# EAGLE design 4_digit_7seg_driver (EAGLE 7.3.0)
CNAME: Alta designs; CREVISION: v0.1; DESIGNER: Eduardo Medeiros
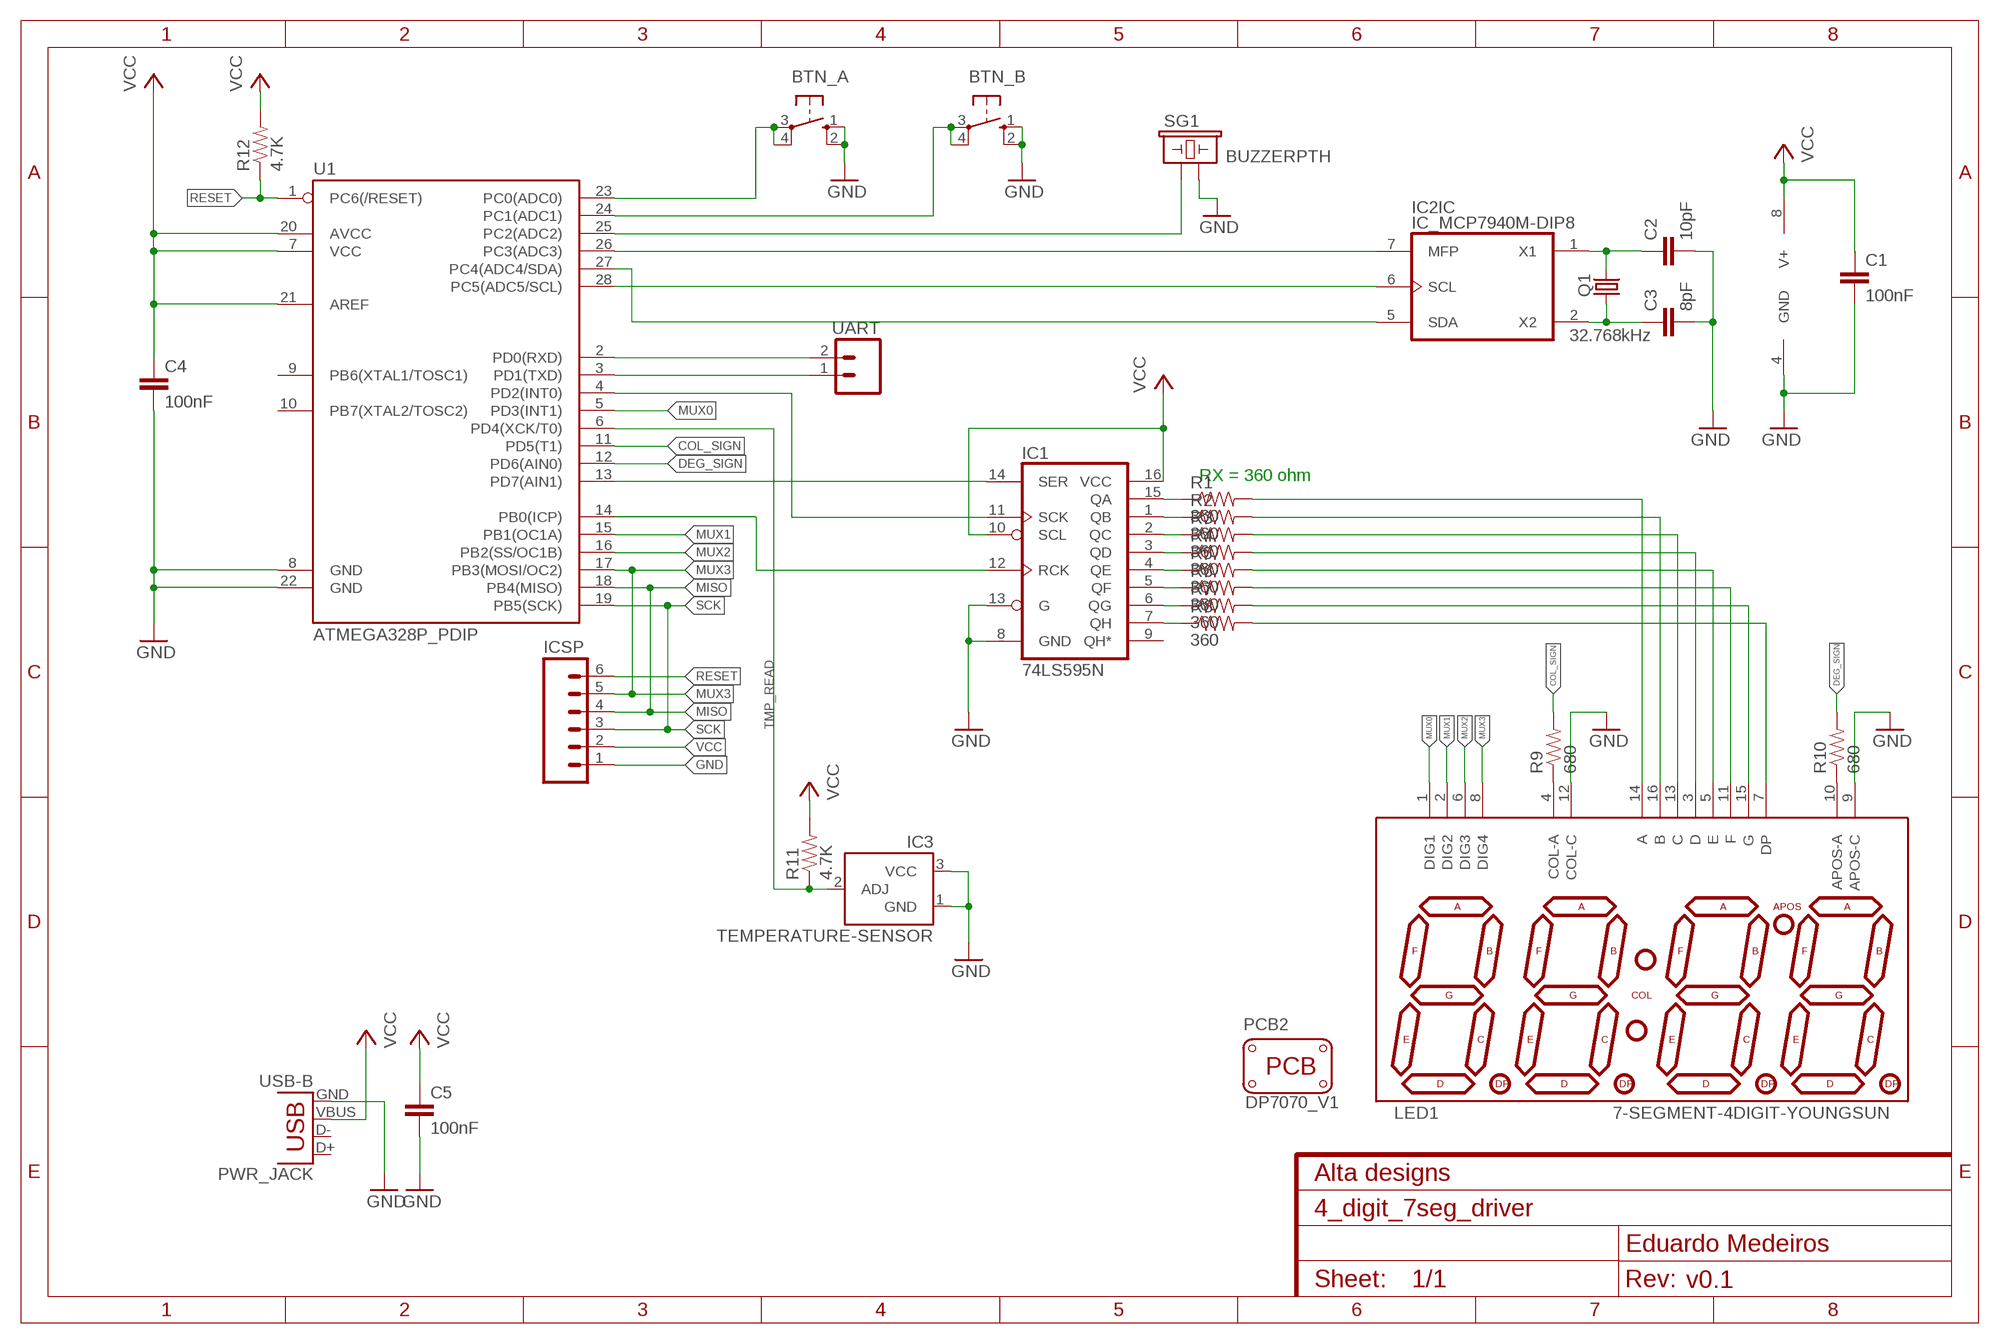
[diagram p0: schematic, sheet 1]

## Parts
BTN_A  40-XX  [B3F-40XX]
BTN_B  40-XX  [B3F-40XX]
C1  100nF  CAPPTH1  [CAP-PTH-5MM]
C2  10pF  CAPPTH  [CAP-PTH-SMALL]
C3  8pF  CAPPTH  [CAP-PTH-SMALL]
C4  100nF  CAPPTH1  [CAP-PTH-5MM]
C5  100nF  CAPPTH1  [CAP-PTH-5MM]
IC1  74LS595N  [DIL16]
IC2  IC_MCP7940M-DIP8  [DIP8]
IC3  TEMPERATURE-SENSOR  [TO-92]
ICSP  M06SILK_FEMALE_PTH  [1X06]
LED1  7-SEGMENT-4DIGIT-YOUNGSUN  [7-SEGMENT-4DIGIT-YOUNGSUN]
PCB2  PCB_DP_SQUARE-7X7  [DP7070_V1]
PWR_JACK  USB-B  USBPTH  [USB-B-PTH]
Q1  32.768kHz  CRYSTALTC26V  [TC26V]
R1  360  RESISTORPTH-1/4W-VERT  [AXIAL-0.1]
R2  360  RESISTORPTH-1/4W-VERT  [AXIAL-0.1]
R3  360  RESISTORPTH-1/4W-VERT  [AXIAL-0.1]
R4  360  RESISTORPTH-1/4W-VERT  [AXIAL-0.1]
R5  360  RESISTORPTH-1/4W-VERT  [AXIAL-0.1]
R6  360  RESISTORPTH-1/4W-VERT  [AXIAL-0.1]
R7  360  RESISTORPTH-1/4W-VERT  [AXIAL-0.1]
R8  360  RESISTORPTH-1/4W-VERT  [AXIAL-0.1]
R9  680  RESISTORPTH-1/4W-VERT  [AXIAL-0.1]
R10  680  RESISTORPTH-1/4W-VERT  [AXIAL-0.1]
R11  4.7K  RESISTORPTH-1/4W-VERT  [AXIAL-0.1]
R12  4.7K  RESISTORPTH-1/4W-VERT  [AXIAL-0.1]
SG1  BUZZERPTH  [BUZZER-12MM]
U1  ATMEGA328P_PDIP  [DIL28-3]
UART  M02PTH  [1X02]

## Nets
A: LED1.14(A) R1.P$2
B: LED1.16(B) R2.P$2
BUTTON_A: BTN_A.3(P) BTN_A.4(P1) U1.23(PC0(ADC0))
BUTTON_B: BTN_B.3(P) BTN_B.4(P1) U1.24(PC1(ADC1))
C: LED1.13(C) R3.P$2
COL_SIGN: R9.P$2 U1.11(PD5(T1))
D: LED1.3(D) R4.P$2
DEG_SIGN: R10.P$2 U1.12(PD6(AIN0))
DP: LED1.7(DP) R8.P$2
E: LED1.5(E) R5.P$2
F: LED1.11(F) R6.P$2
G: LED1.15(G) R7.P$2
GND [power]: BTN_A.1(S) BTN_A.2(S1) BTN_B.1(S) BTN_B.2(S1) C1.2 C2.2 C3.2 C4.2 C5.2 IC1.8(GND) IC1.13(G) IC2.4(SUPPLY:GND) IC3.1(GND) IC3.3(VCC) ICSP.1 LED1.9(APOS-C) LED1.12(COL-C) PWR_JACK.GND SG1.- U1.8(GND) U1.22(GND)
MISO: ICSP.4 U1.18(PB4(MISO))
MUX0: LED1.1(DIG1) U1.5(PD3(INT1))
MUX1: LED1.2(DIG2) U1.15(PB1(OC1A))
MUX2: LED1.6(DIG3) U1.16(PB2(SS/OC1B))
MUX3: ICSP.5 LED1.8(DIG4) U1.17(PB3(MOSI/OC2))
N$1: IC1.15(QA) R1.P$1
N$2: IC1.1(QB) R2.P$1
N$3: IC1.2(QC) R3.P$1
N$4: IC1.3(QD) R4.P$1
N$5: IC1.4(QE) R5.P$1
N$6: IC1.5(QF) R6.P$1
N$7: IC1.6(QG) R7.P$1
N$8: IC1.7(QH) R8.P$1
N$9: LED1.4(COL-A) R9.P$1
N$11: IC2.6(IC:SCL) U1.28(PC5(ADC5/SCL))
N$12: IC2.5(IC:SDA) U1.27(PC4(ADC4/SDA))
N$13: IC2.7(IC:MFP) U1.26(PC3(ADC3))
N$14: SG1.+ U1.25(PC2(ADC2))
N$15: C2.1 IC2.1(IC:X1) Q1.2
N$16: LED1.10(APOS-A) R10.P$1
N$17: C3.1 IC2.2(IC:X2) Q1.1
RESET: ICSP.6 R12.P$1 U1.1(PC6(/RESET))
S_CLK: IC1.11(SCK) U1.4(PD2(INT0))
S_DATA: IC1.14(SER) U1.13(PD7(AIN1))
S_LATCH: IC1.12(RCK) U1.14(PB0(ICP))
SCK: ICSP.3 U1.19(PB5(SCK))
TMP_READ: IC3.2(ADJ) R11.P$1 U1.6(PD4(XCK/T0))
UART_RX: U1.2(PD0(RXD)) UART.2
UART_TX: U1.3(PD1(TXD)) UART.1
VCC [power]: C1.1 C4.1 C5.1 IC1.10(SCL) IC1.16(VCC) IC2.8(SUPPLY:V+) ICSP.2 PWR_JACK.VBUS R11.P$2 R12.P$2 U1.7(VCC) U1.20(AVCC) U1.21(AREF)
Unconnected: IC1.9(QH*) PWR_JACK.D+ PWR_JACK.D- U1.9(PB6(XTAL1/TOSC1)) U1.10(PB7(XTAL2/TOSC2))

## Notes on the sheet
- RX = 360 ohm

## Library data of the parts
BTN_A BTN_B = adafruit:40-XX: OMRON SWITCH; MF: OMRON COMPONENTS USA; MPN: B3F-4000; OC_FARNELL: 176434; OC_NEWARK: 36K3105
C1-C5 = SparkFun-Passives:CAP: Capacitor Standard 0603 ceramic capacitor, and 0.1" leaded capacitor.
IC1 = SparkFun-DigitalIC:74*595: 8-bit SHIFT REGISTER, output latch
IC2 = dp_devices.v6:IC_MCP7940M: I2C RTC/C with SRAM MCP7940M <http://www.microchip.com/wwwproducts/Devices.aspx?dDocName=en557488>
IC3 = SparkFun-Sensors:TEMPERATURE-SENSOR: TO-92 temp sensor
ICSP = SparkFun-Connectors:M06: Header 6 Standard 6-pin 0.1" header. Use with straight break away headers (SKU : PRT-00116), right angle break away headers (PRT-00553), swiss pins (PRT-00743), machine pins (PRT-00117), and female headers (PRT-00115). Molex polarized connector foot print use with SKU : PRT-08094 with associated crimp pins and housings. NOTES ON THE VARIANTS LOCK and LOCK_LONGPADS... This footprint was designed to help hold the alignment of a through-hole component (i.e. 6-pin header) while soldering it into place. You may notice that each hole has been shifted either up or down by 0.005 of an inch from it's more standard position (which is a perfectly straight line). This slight alteration caused the pins (the squares in the middle) to touch the edges of the holes. Because they are alternating, it causes a "brace" to hold the component in place. 0.005 has proven to be the perfect amount of "off-center" position when using our standard breakaway headers. Although looks a little odd when you look at the bare footprint, once you have a header in there, the alteration is very hard to notice. Also,if you push a header all the way into place, it is covered up entirely on the bottom side. This idea of altering the position of holes to aid alignment will be further integrated into the Sparkfun Library for other footprints. It can help hold any component with 3 or more connection pins.; PROD_ID: CONN-08437
LED1 = SparkFun-Displays:7-SEGMENT-4DIGIT-YOUNGSUN: This is a part for the 4-Digit 7-segment LEDs from Young Sun. Different from the Digikey LEDs, all 16 pins are used. The LONGPADS Variant is used for a test jig, but you may like it because there is more pad to solder to. If you are concerned about routing space, the standard works just fine though.
PCB2 = dp_devices:PCB_DP_SQUARE: Dangerous Prototypes Standard Square PCB sizes; PCB_SIZE: DP7070_V1
PWR_JACK = SparkFun-Connectors:USB: USB Connectors USB-B-PTH is fully proven SKU : PRT-00139/CONN-08278 USB-miniB is fully proven SKU : PRT-00587 USB-A-PCB is untested. USB-A-H is throughly reviewed, but untested. Spark Fun Electronics SKU : PRT-00437 USB-B-SMT is throughly reviewed, but untested. Needs silkscreen touching up. USB-A-S has not been used/tested USB-MB-H has not been used/tested USB-MICROB has been used. CONN-09505; PROD_ID: CONN-08278
Q1 = adafruit:CRYSTAL: CRYSTAL; OC_FARNELL: unknown; OC_NEWARK: unknown
R1-R12 = SparkFun-Resistors:RESISTOR: Resistor Basic schematic elements and footprints for 0603, 1206, and PTH resistors.
SG1 = SparkFun-Electromechanical:BUZZER: Buzzer 12mm Spark Fun Electronics SKU : Comp-Buzzer
U1 = SparkFun-DigitalIC:ATMEGA328P_PDIP: uC used in the Arduino 32kb flash, 1k EEPROM, 2k SRAM This is the through-hole version of this chip.
UART = SparkFun-Connectors:M02: Standard 2-pin 0.1" header. Use with - straight break away headers ( PRT-00116) - right angle break away headers (PRT-00553) - swiss pins (PRT-00743) - machine pins (PRT-00117) - female headers (PRT-00115) Molex polarized connector foot print use with: PRT-08233 with associated crimp pins and housings. 2.54_SCREWTERM for use with PRT-10571. 3.5mm Screw Terminal footprints for PRT-08084 5mm Screw Terminal footprints for use with PRT-08432

## Net classes
0 default: width 0.406 mm, drill 0.508 mm, clearance 0.254 mm
1 power: width 0.813 mm, drill 0.508 mm, clearance 0.254 mm

## Board
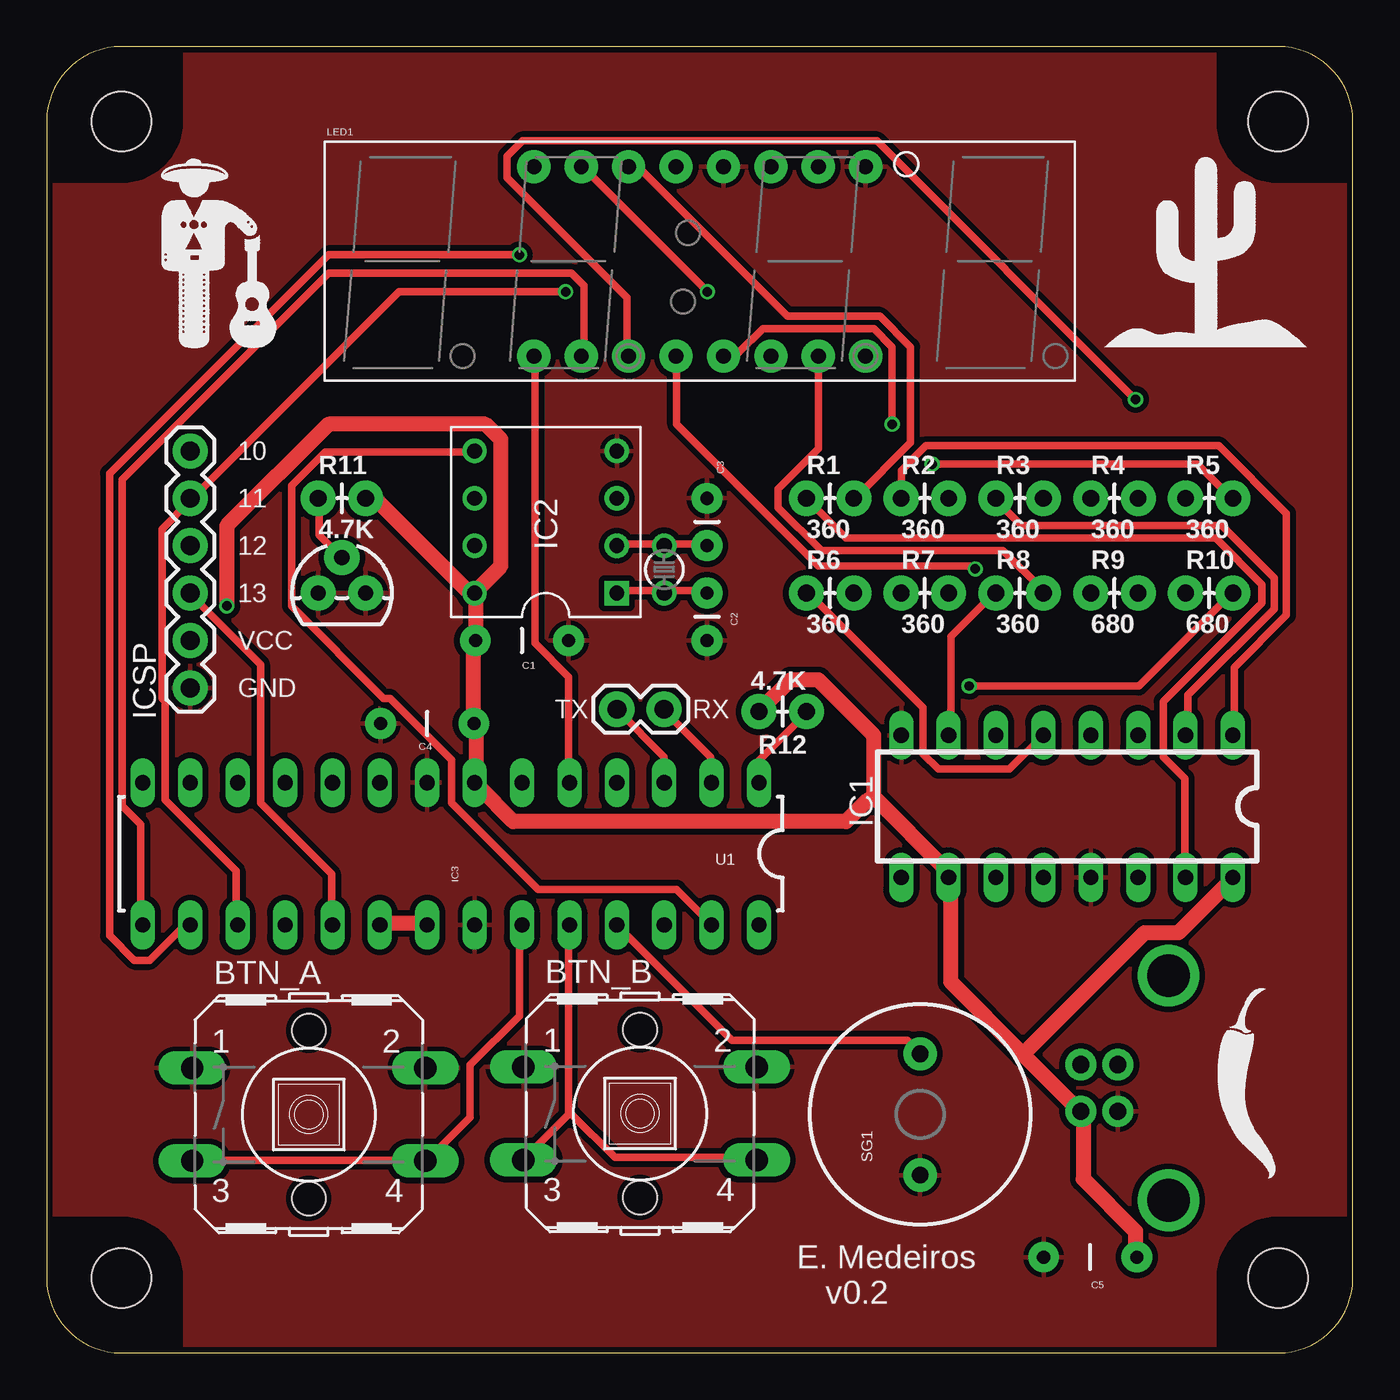
[diagram p1: board, top side]
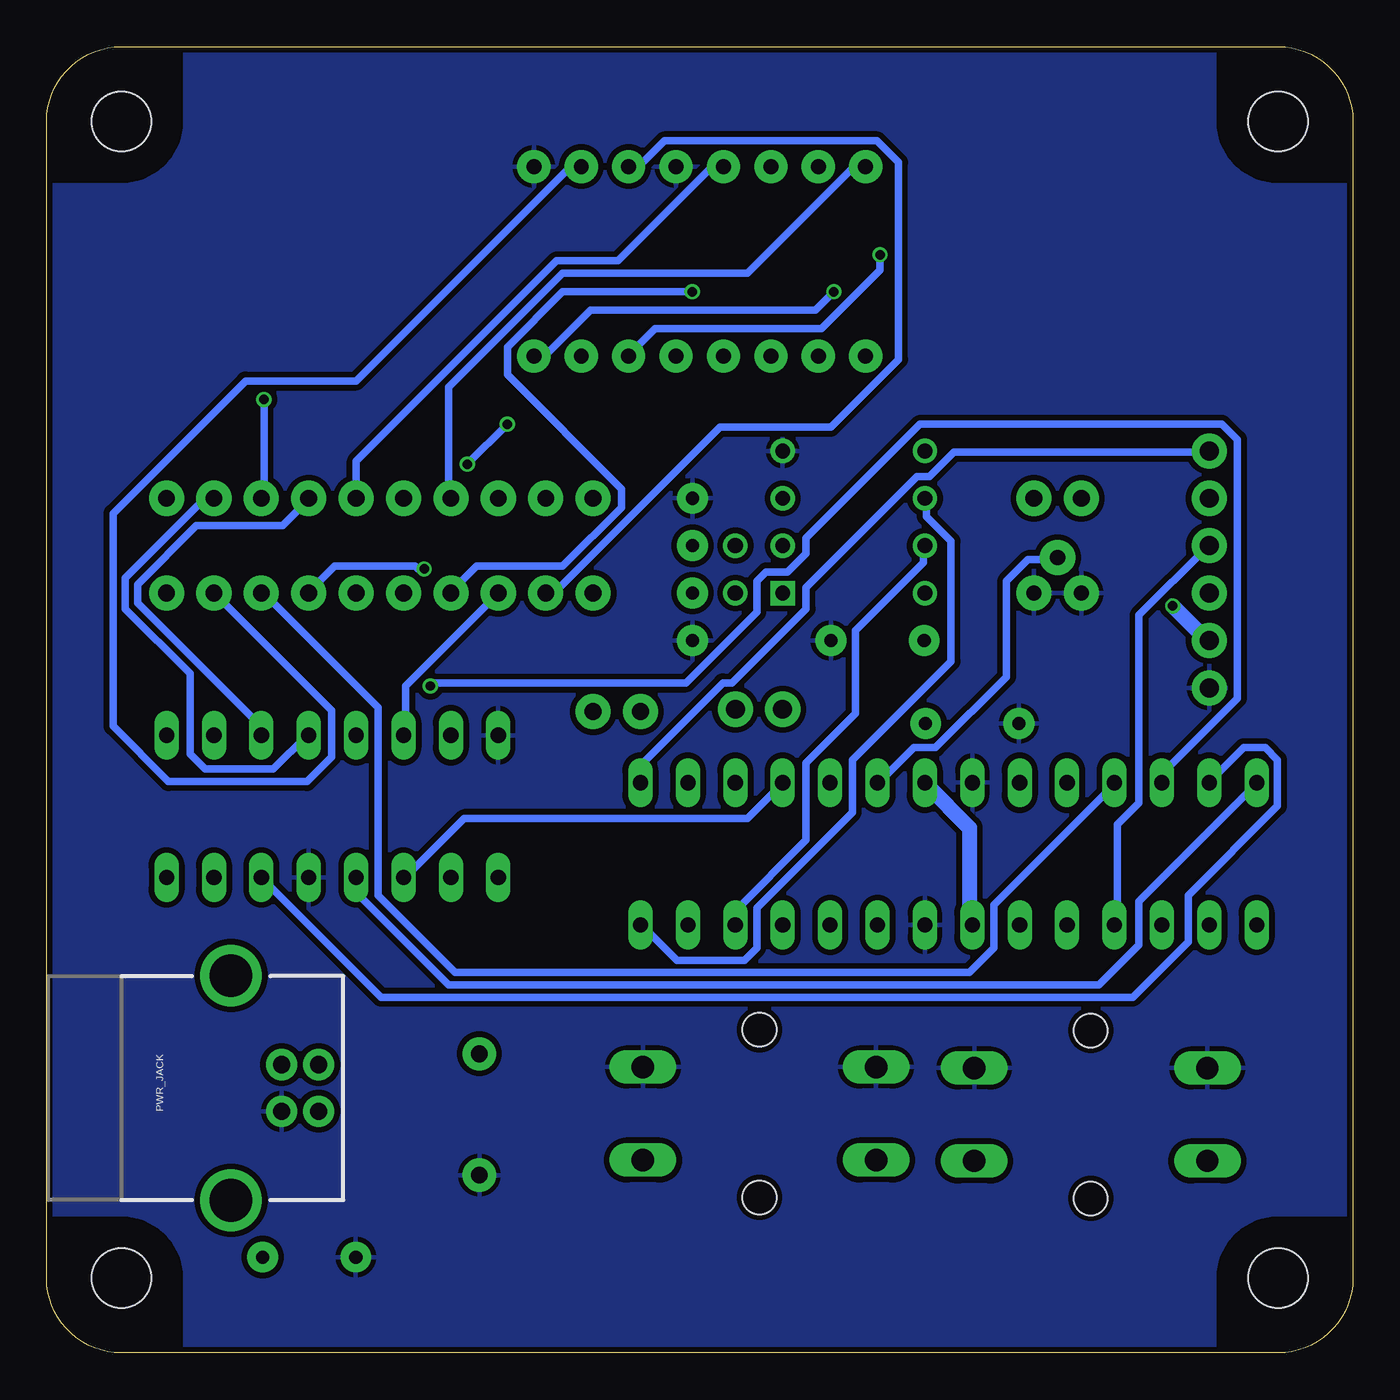
[diagram p2: board, bottom side, seen from below]

Size 70 x 70 mm. Coordinates in mm from the lower left corner, seen from the top.
Copper layers (1*16): Top 0.035mm / dielectric 1.5mm / Bottom 0.035mm
Design rules "dirt_cheap_dirty_boards.v1": minimum track width 5mil, minimum drill 12mil, track to track 5mil, track to pad 5mil, pad to pad 5mil, via to via 5mil, smd to smd 0mil, copper to edge 10mil, drill to drill 10mil, minimum pad ring 10mil, minimum via ring 6mil, stop-mask expansion 2mil, vias tented up to drill 25mil, thermal gap 10mil

### Footprints (pad centres in the part's own frame; a part is rotated, then mirrored left to right if it is on the bottom)
B3F-40XX = drill 1.194 long: 1 -6.248,2.489; 2 6.248,2.489; 3 -6.248,-2.489; 4 6.248,-2.489 | hole 1.803: 0,-4.496; 0,4.496
CAP-PTH-5MM = drill 0.7 pad 1.651: 1 -2.5,0; 2 2.5,0
CAP-PTH-SMALL = drill 0.7 pad 1.651: 1 0,0; 2 2.54,0
DIL16 = drill 0.813 long: 1 -8.89,-3.81; 2 -6.35,-3.81; 3 -3.81,-3.81; 4 -1.27,-3.81; 5 1.27,-3.81; 6 3.81,-3.81; 7 6.35,-3.81; 8 8.89,-3.81; 9 8.89,3.81; 10 6.35,3.81; 11 3.81,3.81; 12 1.27,3.81; 13 -1.27,3.81; 14 -3.81,3.81; 15 -6.35,3.81; 16 -8.89,3.81
DIP8 = drill 0.8 square: 1 -3.81,-3.81 | drill 0.8: 2 -1.27,-3.81; 3 1.27,-3.81; 4 3.81,-3.81; 5 3.81,3.81; 6 1.27,3.81; 7 -1.27,3.81; 8 -3.81,3.81
TO-92 = drill 0.813 pad 1.88: 1 -1.27,0; 2 0,1.905; 3 1.27,0
1X06 = drill 1.016 pad 1.88: 1 0,0; 2 2.54,0; 3 5.08,0; 4 7.62,0; 5 10.16,0; 6 12.7,0
7-SEGMENT-4DIGIT-YOUNGSUN = drill 0.8 pad 1.778: 1 -8.89,-5.08; 2 -6.35,-5.08; 3 -3.81,-5.08; 4 -1.27,-5.08; 5 1.27,-5.08; 6 3.81,-5.08; 7 6.35,-5.08; 8 8.89,-5.08; 9 8.89,5.08; 10 6.35,5.08; 11 3.81,5.08; 12 1.27,5.08; 13 -1.27,5.08; 14 -3.81,5.08; 15 -6.35,5.08; 16 -8.89,5.08
DP7070_V1 = hole 3.2: -31,-31; 31,-31; 31,31; -31,31
USB-B-PTH = drill 0.914 pad 1.676: D+ 0,1.25; D- 1.981,1.25; GND 0,-1.25; VBUS 1.981,-1.25 | drill 2.286: S1 -2.718,-6.02; S2 -2.718,6.02
TC26V = drill 0.813: 1 -1.27,0; 2 1.27,0
AXIAL-0.1 = drill 0.9 pad 1.88: P$1 0,0; P$2 2.54,0
BUZZER-12MM = drill 0.9 pad 1.778: + 3.25,0; - -3.25,0
DIL28-3 = drill 0.813 long: 1 -16.51,-3.81; 2 -13.97,-3.81; 3 -11.43,-3.81; 4 -8.89,-3.81; 5 -6.35,-3.81; 6 -3.81,-3.81; 7 -1.27,-3.81; 8 1.27,-3.81; 9 3.81,-3.81; 10 6.35,-3.81; 11 8.89,-3.81; 12 11.43,-3.81; 13 13.97,-3.81; 14 16.51,-3.81; 15 16.51,3.81; 16 13.97,3.81; 17 11.43,3.81; 18 8.89,3.81; 19 6.35,3.81; 20 3.81,3.81; 21 1.27,3.81; 22 -1.27,3.81; 23 -3.81,3.81; 24 -6.35,3.81; 25 -8.89,3.81; 26 -11.43,3.81; 27 -13.97,3.81; 28 -16.51,3.81
1X02 = drill 1.016 pad 1.88: 1 0,0; 2 2.54,0

### Placement (x,y rotation side)
BTN_A  14.05,12.78 0 top
BTN_B  31.8,12.83 0 top
C1  25.48,38.18 0 top
C2  35.38,40.72 270 top
C3  35.38,43.26 90 top
C4  20.4,33.73 180 top
C5  55.93,5.13 180 top
IC1  54.69,29.29 180 top
IC2  26.75,44.53 90 top
IC3  15.82,40.72 0 top
ICSP  7.7,35.64 90 top
LED1  35,58.5 0 top
PCB2  35,35 0 top
PWR_JACK  57.4,14.2 0 bottom
Q1  33.1,41.98 270 top
R1  40.72,45.8 0 top
R2  45.8,45.8 0 top
R3  50.88,45.8 0 top
R4  55.96,45.8 0 top
R5  61.04,45.8 0 top
R6  40.72,40.72 0 top
R7  45.8,40.72 0 top
R8  50.88,40.72 0 top
R9  55.96,40.72 0 top
R10  61.04,40.72 0 top
R11  14.55,45.8 0 top
R12  40.72,34.37 180 top
SG1  46.81,12.78 90 top
U1  21.67,26.75 180 top
UART  30.56,34.49 0 top

### Tracks (layer width: path | path; a pad name or v marks a point on that pad's centre or on a via)
A
  Top 0.406: LED1.14 31.28,63.47 31.77,63.47 39.7,55.55 44.65,55.55 46.3,53.9 46.3,48.78 43.33,45.81 R1.P$2
B
  Bottom 0.406: LED1.16 26.16,63.47 26.82,63.47 32.44,57.86 42.34,57.86 48.45,51.75 48.45,45.81 R2.P$2
BUTTON_A
  Top 0.406: U1.23 25.34,22.86 25.34,18.07 22.69,15.43 22.69,12.62 20.38,10.31 BTN_A.4 20.22,10.31 7.84,10.31 BTN_A.3
BUTTON_B
  Top 0.406: 27.98,12.79 27.98,22.86 U1.24 | 27.98,12.79 25.67,10.48 BTN_B.3 | BTN_B.4 38.05,10.48 30.45,10.48 28.14,12.79 27.98,12.79
C
  Bottom 0.406: LED1.13 33.76,63.47 34.42,63.47 39.37,58.52 42.67,58.52 53.4,47.79 53.4,45.81 R3.P$2
COL_SIGN
  Bottom 0.406: U1.11 12.79,30.45 19.23,24.01 19.23,21.7 20.55,20.38 48.12,20.38 52.25,24.51 52.25,34.58 58.36,40.69 R9.P$2
D  (via drill 0.51)
  Top 0.406: v58.36,51.09 44.49,64.96 25.5,64.96 24.68,64.13 24.68,62.98 31.11,56.54 31.11,53.57 LED1.3
  Bottom 0.406: v58.36,51.09 58.36,45.81 R4.P$2
DEG_SIGN  (via drill 0.51)
  Top 0.406: v49.44,35.74 58.52,35.74 63.47,40.69 R10.P$2
  Bottom 0.406: v49.44,35.74 49.28,35.9 35.74,35.9 31.94,39.7 31.94,41.35 31.44,41.85 30.29,41.85 29.3,42.84 29.3,43.66 23.19,49.77 7.01,49.77 6.18,48.95 6.18,35.08 10.15,31.11 10.15,30.62 U1.12
DP
  Top 0.406: LED1.7 41.35,48.45 39.2,46.3 39.2,45.31 41.52,43 51.26,43 53.4,40.86 R8.P$2
E  (via drill 0.51)
  Top 0.406: v45.31,49.77 45.31,53.9 44.32,54.89 38.38,54.89 37.06,53.57 36.4,53.57 LED1.5 | v47.46,47.62 61.66,47.62 63.47,45.81 R5.P$2
  Bottom 0.406: v47.46,47.62 v45.31,49.77
F
  Bottom 0.406: LED1.11 38.71,63.64 38.21,63.64 36.89,64.96 25.5,64.96 24.35,63.8 24.35,53.24 27.98,49.61 33.92,49.61 42.67,40.86 43.17,40.86 R6.P$2
G  (via drill 0.51)
  Top 0.406: v35.41,56.87 28.8,63.47 LED1.15
  Bottom 0.406: v35.41,56.87 42.34,56.87 45.31,53.9 45.31,52.41 39.2,46.3 39.2,45.31 42.34,42.18 46.96,42.18 48.28,40.86 R7.P$2
GND
  pour Bottom (isolate 0.305): -5,73.73 -5,-2.46 71.2,-2.46 71.2,73.73
  pour Top (isolate 0.305): -5,71.2 -5,-5 71.2,-5 71.2,71.2
MISO
  Bottom 0.406: U1.18 12.62,23.02 12.62,28.31 11.47,29.46 11.47,39.53 7.84,43.17 ICSP.4
MUX0
  Top 0.406: U1.5 27.98,30.62 27.98,36.23 26.16,38.05 26.16,53.4 LED1.1
MUX1
  Top 0.406: U1.15 5.03,23.02 5.03,28.31 4.04,29.3 4.04,46.8 15.1,57.86 28.14,57.86 28.8,57.2 28.8,53.57 LED1.2
MUX2  (via drill 0.51)
  Top 0.406: v25.34,58.85 15.1,58.85 3.38,47.13 3.38,22.36 4.7,21.04 5.52,21.04 7.34,22.86 7.67,22.86 U1.16
  Bottom 0.406: v25.34,58.85 25.34,58.03 28.47,54.89 37.39,54.89 38.71,53.57 LED1.6
MUX3  (via drill 0.51)
  Top 0.406: U1.17 10.15,23.02 10.15,25.83 6.35,29.63 6.35,34.91 6.18,35.08 6.18,44.16 7.67,45.64 ICSP.5 7.84,45.81 18.9,56.87 v27.81,56.87
  Bottom 0.406: v27.81,56.87 28.8,55.88 40.86,55.88 43.17,53.57 43.83,53.57 LED1.8
N$1
  Top 0.406: IC1.15 61,25.5 61,30.78 59.84,31.94 59.84,34.91 65.12,40.19 65.12,41.19 62.65,43.66 42.84,43.66 40.86,45.64 R1.P$1
N$2
  Top 0.406: IC1.1 63.64,33.1 63.64,36.73 66.45,39.53 66.45,44.98 62.81,48.61 47.13,48.61 45.81,47.29 45.81,45.81 R2.P$1
N$3
  Top 0.406: IC1.2 61.16,33.1 61.16,35.24 65.78,39.86 65.78,41.52 62.98,44.32 52.25,44.32 50.93,45.64 R3.P$1
N$4
  Bottom 0.406: IC1.3 58.52,33.1 58.52,33.59 65.12,40.19 65.12,41.19 61.99,44.32 57.37,44.32 56.04,45.64 R4.P$1
N$5
  Bottom 0.406: IC1.4 56.04,33.1 57.86,31.28 61.49,31.28 62.32,32.1 62.32,36.4 65.78,39.86 65.78,41.52 61.66,45.64 61.16,45.64 R5.P$1
N$6
  Top 0.406: IC1.5 53.4,33.1 51.59,31.28 47.79,31.28 46.96,32.1 46.96,34.58 40.86,40.69 R6.P$1
N$7
  Bottom 0.406: IC1.6 50.76,33.1 50.76,35.74 45.81,40.69 R7.P$1
N$8
  Top 0.406: IC1.7 48.45,33.1 48.45,38.38 50.76,40.69 R8.P$1
N$9  (via drill 0.51)
  Top 0.406: v49.77,42.01 49.61,42.18 41.35,42.18 33.76,49.77 33.76,53.4 LED1.4
  Bottom 0.406: v49.77,42.01 50.1,42.01 50.27,42.18 54.56,42.18 55.88,40.86 R9.P$1
N$11
  Bottom 0.406: IC2.6 22.86,45.64 22.86,44.82 21.54,43.5 21.54,37.06 26.82,31.77 26.82,28.97 31.94,23.85 31.94,21.7 32.6,21.04 36.23,21.04 38.05,22.86 U1.28
N$12
  Top 0.406: IC2.5 22.86,48.28 14.93,48.28 13.12,46.47 13.12,40.03 18.07,35.08 18.4,35.08 21.7,31.77 21.7,29.46 26.33,24.84 33.76,24.84 35.57,23.02 U1.27
N$13
  Bottom 0.406: U1.26 33.1,23.68 29.3,27.48 29.3,31.61 26.66,34.25 26.66,38.71 23.02,42.34 23.02,43.17 IC2.7
N$14
  Top 0.406: U1.25 30.62,22.86 36.73,16.75 46.14,16.75 46.8,16.09 SG1.+
N$15
  Top 0.406: IC2.1 30.62,40.86 33.1,40.86 Q1.2 33.26,40.86 35.24,40.86 C2.1
N$16
  Bottom 0.406: LED1.10 41.35,63.47 42.01,63.47 53.4,52.08 59.35,52.08 66.45,44.98 66.45,33.59 63.47,30.62 56.04,30.62 54.72,31.94 54.72,34.42 61,40.69 R10.P$1
N$17
  Top 0.406: IC2.2 30.62,43.33 33.1,43.33 Q1.1 33.26,43.33 35.24,43.33 C3.1
RESET
  Top 0.406: U1.1 38.21,30.62 38.21,31.77 40.69,34.25 R12.P$1
  Bottom 0.406: ICSP.6 7.84,48.28 21.37,48.28 22.69,46.96 23.35,46.96 29.3,41.02 29.3,39.86 33.26,35.9 33.76,35.9 38.05,31.61 38.05,30.62 U1.1
S_CLK
  Bottom 0.406: IC1.11 50.76,25.5 47.62,28.64 32.44,28.64 30.62,30.45 U1.4
S_DATA
  Bottom 0.406: IC1.14 52.08,19.06 11.8,19.06 8.83,22.03 8.83,24.51 4.04,29.3 4.04,31.77 4.7,32.44 5.85,32.44 7.67,30.62 U1.13
S_LATCH
  Bottom 0.406: IC1.12 53.4,25.34 53.4,24.68 48.45,19.72 13.61,19.72 11.47,21.87 11.47,24.18 5.19,30.45 U1.14
SCK
  Top 0.406: U1.19 15.26,23.02 15.26,25.67 11.47,29.46 11.47,36.89 7.67,40.69 ICSP.3
TMP_READ
  Top 0.406: R11.P$1 14.6,45.64 14.6,43.83 15.76,42.67 IC3.2
  Bottom 0.406: U1.6 25.34,30.62 23.52,32.44 22.36,32.44 18.57,36.23 18.57,41.35 17.41,42.51 15.93,42.51 IC3.2
UART_RX
  Top 0.406: U1.2 35.57,30.62 35.57,31.94 33.1,34.42 UART.2
UART_TX
  Top 0.406: U1.3 33.1,31.94 30.62,34.42 UART.1
VCC  (via drill 0.51)
  Top 0.813: U1.20 17.91,23.02 20.38,23.02 U1.21 | IC2.8 23.02,40.69 23.02,38.21 C1.1 22.86,37.88 22.86,34.09 C4.1 23.02,33.59 23.02,30.62 U1.7 23.19,30.29 25.01,28.47 42.84,28.47 43.99,29.63 44.32,29.79 | v9.65,40.03 9.65,44.32 15.1,49.77 23.52,49.77 24.35,48.95 24.35,42.18 23.19,41.02 IC2.8 | R11.P$2 17.25,45.64 17.74,45.64 22.53,40.86 IC2.8 | 52.33,16.01 55.38,12.95 PWR_JACK.VBUS 55.55,12.62 55.55,9.32 58.36,6.51 58.36,5.19 C5.1 | 52.33,16.01 48.45,19.89 48.45,25.34 IC1.10 48.28,25.83 44.32,29.79 | 52.33,16.01 58.85,22.53 60.67,22.53 63.47,25.34 IC1.16 | 44.32,29.79 44.32,33.1 41.35,36.07 39.86,36.07 38.21,34.42 R12.P$2
  Bottom 0.813: U1.21 20.55,23.02 20.55,28.14 22.86,30.45 U1.7 | v9.65,40.03 7.84,38.21 ICSP.2

### Text on the board
tNames: 10 | 11 | 12 | 13 | VCC | GND | TX | RX | E. Medeiros / v0.2